# EAGLE design cubey_v2 (EAGLE 8.7.1)
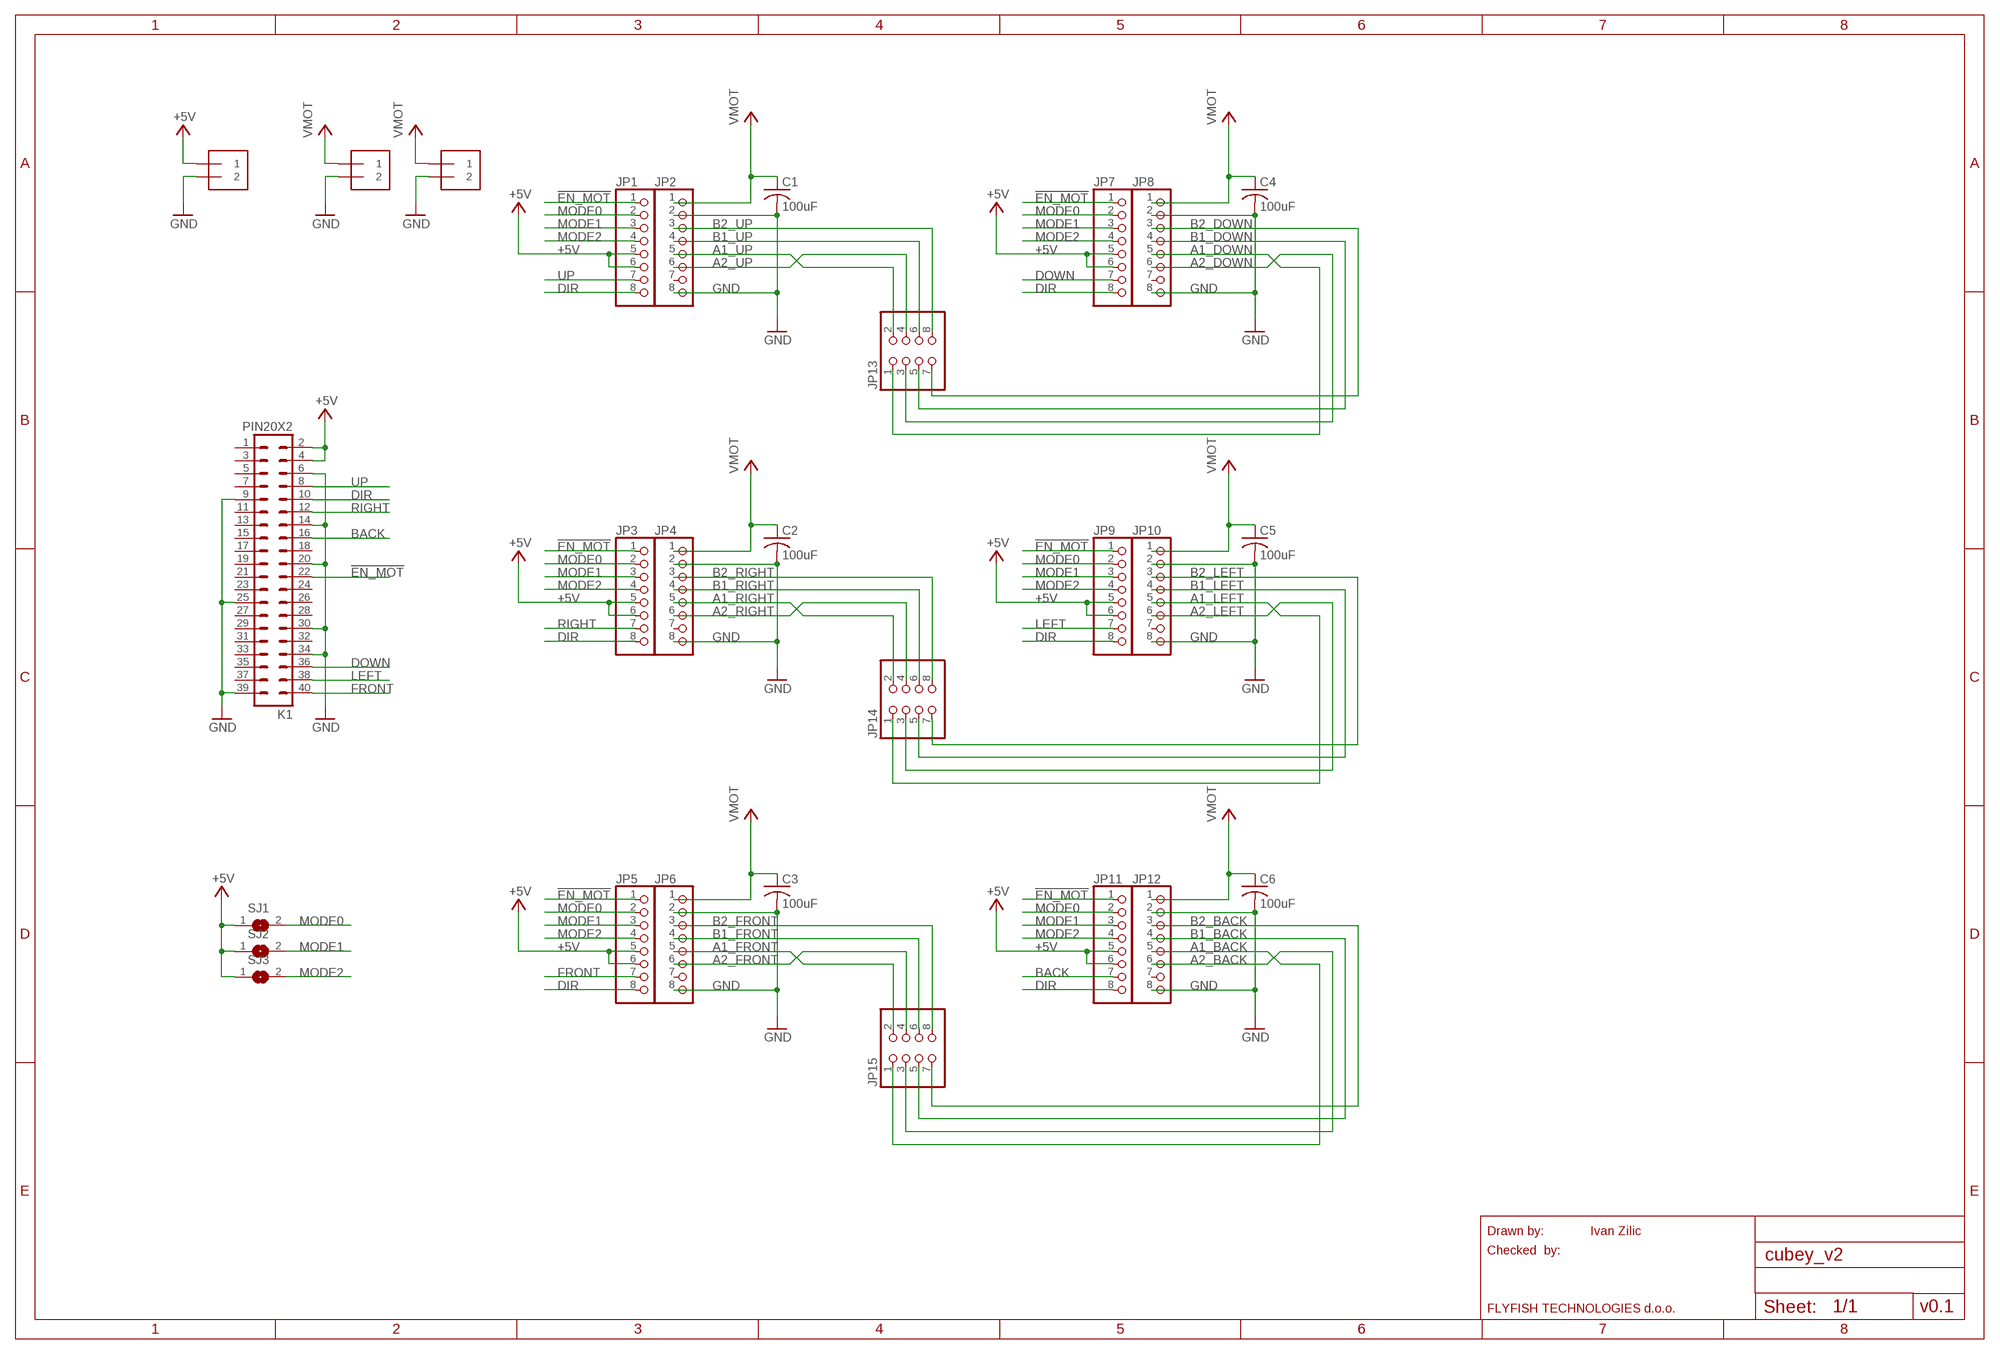
[diagram p0: schematic, sheet 1]

## Parts
5V_PWR  1X2-3.5MM  [1X2-3.5MM]
C1  100uF  C-US025-025X050  [C025-025X050]
C2  100uF  C-US025-025X050  [C025-025X050]
C3  100uF  C-US025-025X050  [C025-025X050]
C4  100uF  C-US025-025X050  [C025-025X050]
C5  100uF  C-US025-025X050  [C025-025X050]
C6  100uF  C-US025-025X050  [C025-025X050]
JP1  PINHD-1X8  [1X08]
JP2  PINHD-1X8  [1X08]
JP3  PINHD-1X8  [1X08]
JP4  PINHD-1X8  [1X08]
JP5  PINHD-1X8  [1X08]
JP6  PINHD-1X8  [1X08]
JP7  PINHD-1X8  [1X08]
JP8  PINHD-1X8  [1X08]
JP9  PINHD-1X8  [1X08]
JP10  PINHD-1X8  [1X08]
JP11  PINHD-1X8  [1X08]
JP12  PINHD-1X8  [1X08]
JP13  PINHD-2X4  [2X04]
JP14  PINHD-2X4  [2X04]
JP15  PINHD-2X4  [2X04]
K1  PIN20X2  [PIN_20X2]
MOT_PWR  1X2-3.5MM  [1X2-3.5MM]
MOT_PWR1  1X2-3.5MM  [1X2-3.5MM]
SJ1  SJ  [SJ]
SJ2  SJ  [SJ]
SJ3  SJ  [SJ]

## Nets
!EN_MOT: JP1.1 JP3.1 JP5.1 JP7.1 JP9.1 JP11.1 K1.22
+5V: 5V_PWR.1 JP1.5 JP1.6 JP3.5 JP3.6 JP5.5 JP5.6 JP7.5 JP7.6 JP9.5 JP9.6 JP11.5 JP11.6 K1.2 K1.4 SJ1.1 SJ2.1 SJ3.1
A1_BACK: JP12.5 JP15.1
A1_DOWN: JP8.5 JP13.1
A1_FRONT: JP6.5 JP15.2
A1_LEFT: JP10.5 JP14.1
A1_RIGHT: JP4.5 JP14.2
A1_UP: JP2.5 JP13.2
A2_BACK: JP12.6 JP15.3
A2_DOWN: JP8.6 JP13.3
A2_FRONT: JP6.6 JP15.4
A2_LEFT: JP10.6 JP14.3
A2_RIGHT: JP4.6 JP14.4
A2_UP: JP2.6 JP13.4
B1_BACK: JP12.4 JP15.5
B1_DOWN: JP8.4 JP13.5
B1_FRONT: JP6.4 JP15.6
B1_LEFT: JP10.4 JP14.5
B1_RIGHT: JP4.4 JP14.6
B1_UP: JP2.4 JP13.6
B2_BACK: JP12.3 JP15.7
B2_DOWN: JP8.3 JP13.7
B2_FRONT: JP6.3 JP15.8
B2_LEFT: JP10.3 JP14.7
B2_RIGHT: JP4.3 JP14.8
B2_UP: JP2.3 JP13.8
BACK: JP11.7 K1.16
DIR: JP1.8 JP3.8 JP5.8 JP7.8 JP9.8 JP11.8 K1.10
DOWN: JP7.7 K1.36
FRONT: JP5.7 K1.40
GND: 5V_PWR.2 C1.2 C2.2 C3.2 C4.2 C5.2 C6.2 JP2.2 JP2.8 JP4.2 JP4.8 JP6.2 JP6.8 JP8.2 JP8.8 JP10.2 JP10.8 JP12.2 JP12.8 K1.6 K1.9 K1.14 K1.20 K1.25 K1.30 K1.34 K1.39 MOT_PWR1.2 MOT_PWR.2
LEFT: JP9.7 K1.38
MODE0: JP1.2 JP3.2 JP5.2 JP7.2 JP9.2 JP11.2 SJ1.2
MODE1: JP1.3 JP3.3 JP5.3 JP7.3 JP9.3 JP11.3 SJ2.2
MODE2: JP1.4 JP3.4 JP5.4 JP7.4 JP9.4 JP11.4 SJ3.2
RIGHT: JP3.7 K1.12
UP: JP1.7 K1.8
VCC: C1.1 C2.1 C3.1 C4.1 C5.1 C6.1 JP2.1 JP4.1 JP6.1 JP8.1 JP10.1 JP12.1 MOT_PWR1.1 MOT_PWR.1 ; supply symbol labelled VMOT
Unconnected: JP2.7 JP4.7 JP6.7 JP8.7 JP10.7 JP12.7 K1.1 K1.3 K1.5 K1.7 K1.11 K1.13 K1.15 K1.17 K1.18 K1.19 K1.21 K1.23 K1.24 K1.26 K1.27 K1.28 K1.29 K1.31 K1.32 K1.33 K1.35 K1.37

## Notes on the sheet
- Drawn by: | Ivan Zilic
- Checked  by:
- FLYFISH TECHNOLOGIES d.o.o. | v0.1

## Library data of the parts
5V_PWR MOT_PWR MOT_PWR1 = adafruit:1X2: 3.5mm Terminal block http://www.ladyada.net/library/pcb/eaglelibrary.html
C1-C6 = rcl:C-US: CAPACITOR, American symbol; SPICEPREFIX: C
JP1-JP12 = pinhead:PINHD-1X8: PIN HEADER
JP13-JP15 = pinhead:PINHD-2X4: PIN HEADER
K1 = FLYFISH:PIN20X2
SJ1-SJ3 = jumper:SJ: SMD solder JUMPER

## Net classes
0 default: width 0.406 mm, clearance 0.203 mm

## Board
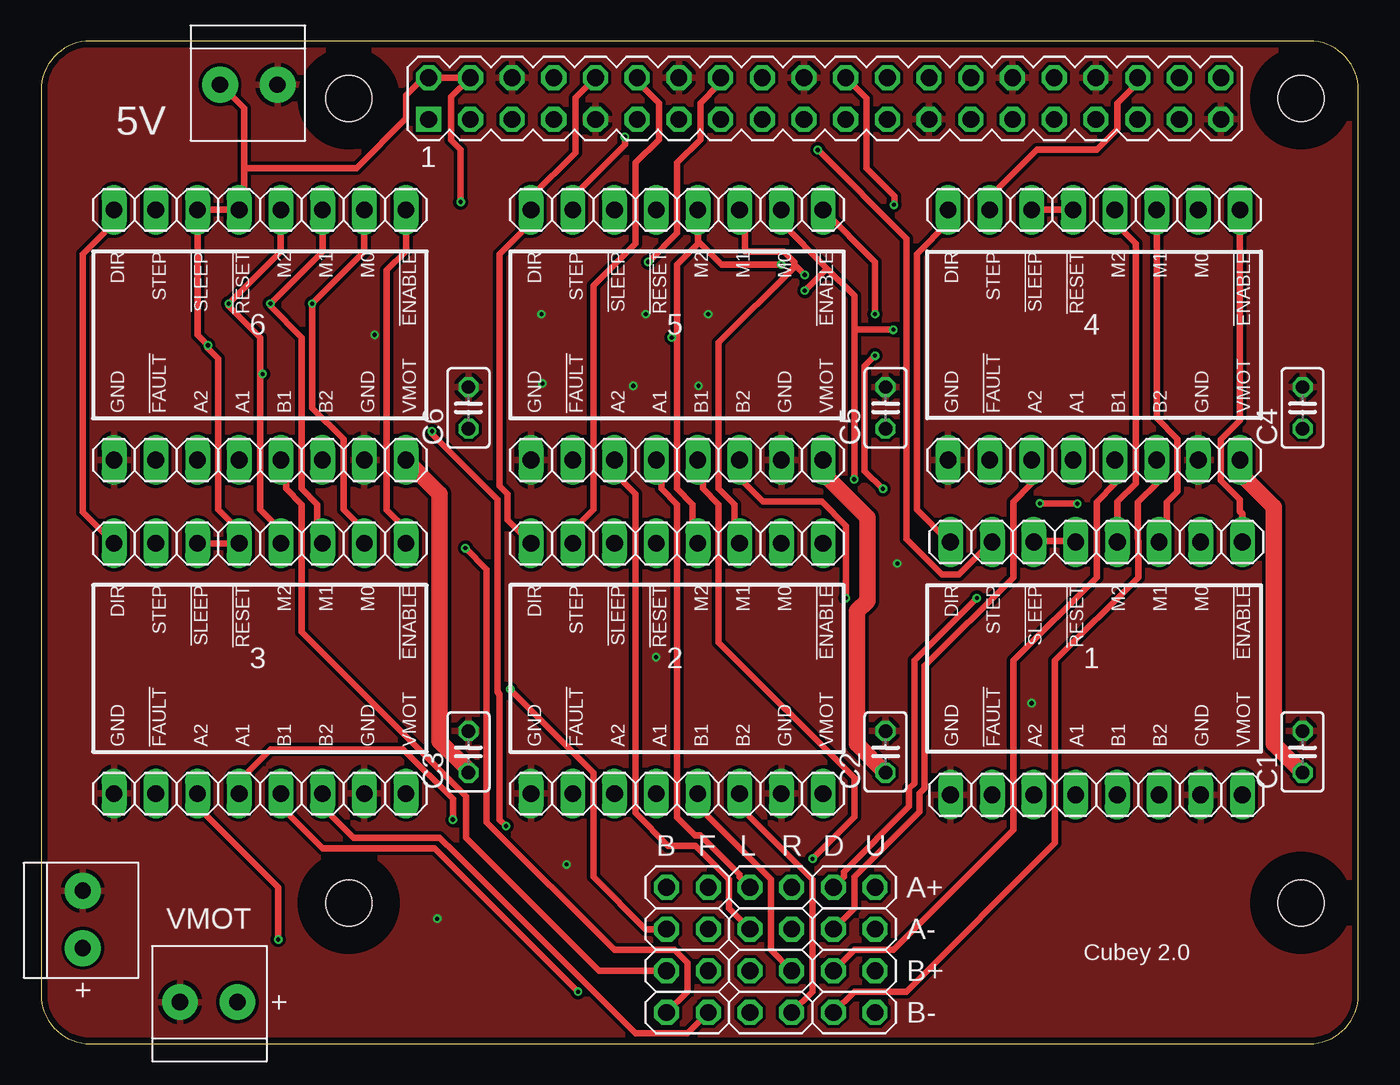
[diagram p1: board, top side]
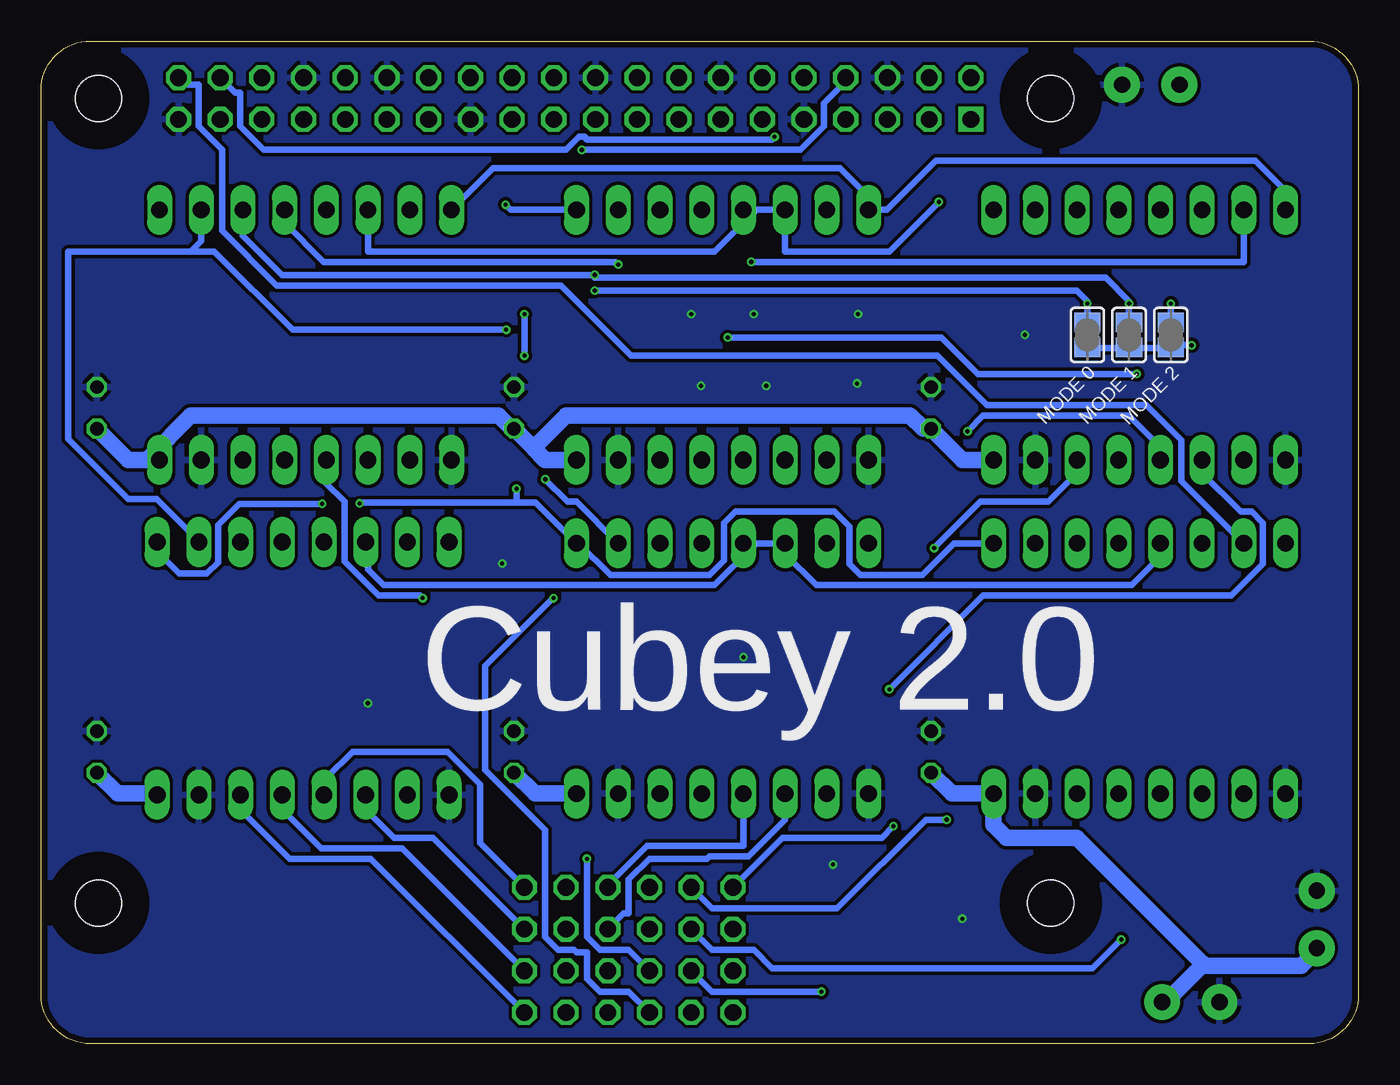
[diagram p2: board, bottom side, seen from below]

Size 80.24 x 61.08 mm. Coordinates in mm from the lower left corner, seen from the top.
Outline: 0,3 arc90 3,0 77.24,0 arc90 80.24,3 80.24,58.08 arc90 77.24,61.08 3,61.08 arc90 0,58.08 0,3
Copper layers (1*16): Top 0.035559375mm / dielectric 1.6mm / Bottom 0.035559375mm
Design rules "oshpark-2layer": minimum track width 6mil, minimum drill 10mil, track to track 6mil, track to pad 6mil, pad to pad 6mil, via to via 6mil, smd to smd 6mil, copper to edge 15mil, drill to drill 6mil, minimum pad ring 5mil, minimum via ring 5mil, stop-mask expansion 2.5mil, vias tented up to drill 0mil, thermal gap 10mil
Holes 2.8 mm at 18.74,8.58 18.74,57.58 76.74,57.58 76.74,8.58
tRestrict: area 17.2,56 to 20.3,59.1; area 75.2,56 to 78.3,59.1; area 75.2,7 to 78.3,10.1; area 17.2,7 to 20.3,10.1
bRestrict: area 17.2,7 to 20.3,10.1; area 17.2,56 to 20.3,59.1; area 75.2,7 to 78.3,10.1; area 75.2,56 to 78.3,59.1

### Footprints (pad centres in the part's own frame; a part is rotated, then mirrored left to right if it is on the bottom)
1X2-3.5MM = drill 1 pad 2.184: 1 1.8,0; 2 -1.7,0
C025-025X050 = drill 0.813 octagon: 1 -1.27,0; 2 1.27,0
1X08 = drill 1.016 long: 1 -8.89,0; 2 -6.35,0; 3 -3.81,0; 4 -1.27,0; 5 1.27,0; 6 3.81,0; 7 6.35,0; 8 8.89,0
2X04 = drill 1.016 octagon: 1 -3.81,-1.27; 2 -3.81,1.27; 3 -1.27,-1.27; 4 -1.27,1.27; 5 1.27,-1.27; 6 1.27,1.27; 7 3.81,-1.27; 8 3.81,1.27
PIN_20X2 = drill 1.016 square: 1 -24.13,-1.27 | drill 1.016 octagon: 2 -24.13,1.27; 3 -21.59,-1.27; 4 -21.59,1.27; 5 -19.05,-1.27; 6 -19.05,1.27; 7 -16.51,-1.27; 8 -16.51,1.27; 9 -13.97,-1.27; 10 -13.97,1.27; 11 -11.43,-1.27; 12 -11.43,1.27; 13 -8.89,-1.27; 14 -8.89,1.27; 15 -6.35,-1.27; 16 -6.35,1.27; 17 -3.81,-1.27; 18 -3.81,1.27; 19 -1.27,-1.27; 20 -1.27,1.27; 21 1.27,-1.27; 22 1.27,1.27; 23 3.81,-1.27; 24 3.81,1.27; 25 6.35,-1.27; 26 6.35,1.27; 27 8.89,-1.27; 28 8.89,1.27; 29 11.43,-1.27; 30 11.43,1.27; 31 13.97,-1.27; 32 13.97,1.27; 33 16.51,-1.27; 34 16.51,1.27; 35 19.05,-1.27; 36 19.05,1.27; 37 21.59,-1.27; 38 21.59,1.27; 39 24.13,-1.27; 40 24.13,1.27
SJ = smd 1.168 x 1.6: 1 -0.762,0; 2 0.762,0

### Placement (x,y rotation side)
5V_PWR  12.7,58.42 180 top
C1  76.83,17.78 90 top
C2  51.44,17.78 90 top
C3  26.04,17.78 90 top
C4  76.83,38.73 90 top
C5  51.44,38.73 90 top
C6  26.04,38.73 90 top
JP1  64.28,30.57 180 top
JP2  64.28,15.16 180 top
JP3  38.73,30.48 180 top
JP4  38.73,15.24 180 top
JP5  13.34,30.48 180 top
JP6  13.34,15.24 180 top
JP7  64.14,50.8 180 top
JP8  64.14,35.56 180 top
JP9  38.73,50.8 180 top
JP10  38.73,35.56 180 top
JP11  13.34,50.8 180 top
JP12  13.34,35.56 180 top
JP13  49.53,5.71 270 top
JP14  44.45,5.71 270 top
JP15  39.37,5.71 270 top
K1  47.74,57.58 0 top
MOT_PWR  10.16,2.54 0 top
MOT_PWR1  2.54,7.62 270 top
SJ1  16.51,43.18 90 bottom
SJ2  13.97,43.18 90 bottom
SJ3  11.43,43.18 90 bottom

### Tracks (layer width: path | path; a pad name or v marks a point on that pad's centre or on a via)
!EN_MOT  (via drill 0.25)
  Top 0.406: JP7.1 73.03,37.97 71.86,36.81 71.86,34.31 73.03,33.15 73.03,32.44 73.17,32.29 JP1.1 | v60.83,32.92 63.09,32.92 v63.12,32.89 | JP9.1 50.8,47.62 v50.8,44.45 | v50.8,41.91 50.16,41.27 50.16,34.9 51.26,33.81 v51.28,33.81 | JP11.1 22.23,48.28 21.06,47.12 21.06,32.51 22.25,31.32 22.25,30.5 JP5.1 | K1.22 50.27,57.59 50.27,53.34 51.97,51.64 51.97,51.13 v51.94,51.1
  Bottom 0.406: v60.83,32.92 60.78,32.97 51.28,32.97 | v63.12,32.89 68.18,32.89 69.46,31.61 69.46,29.32 70.15,28.64 71.81,28.64 73.17,29.99 JP1.1 | 51.28,32.97 50.11,32.97 JP3.1 47.5,30.48 45.57,28.55 39.52,28.55 38.63,29.44 38.63,31.73 37.95,32.41 31.9,32.41 31.01,31.52 31.01,29.23 30.33,28.55 26.55,28.55 24.62,30.48 JP5.1 | v50.8,44.45 v50.8,41.91 | v51.28,33.81 51.28,32.97 | v51.94,51.1 51.64,50.8 JP9.1
+5V  (via drill 0.25)
  Top 0.406: JP7.5 JP7.6 | JP1.6 60.48,30.64 62.87,30.64 JP1.5 | JP5.6 JP5.5 11.59,30.64 11.59,31.75 10.79,32.54 10.79,41.75 10.16,42.39 v10.16,42.55 9.53,43.18 JP11.6 JP11.5 12.06,51.91 12.38,52.23 12.38,53.34 | 12.38,53.34 19.21,53.34 22.23,56.37 22.23,57.8 23.29,58.85 K1.2 K1.4 24.98,57.68 24.98,55.03 25.56,54.45 v25.56,51.28 | 12.38,53.34 12.38,56.99 10.95,58.42 5V_PWR.1
  Bottom 0.406: SJ1.1 16.51,42.39 14.13,42.39 SJ2.1 13.97,42.39 11.43,42.39 SJ3.1 11.27,42.55 v10.16,42.55 | JP5.5 12.06,29.69 13.81,27.94 33.02,27.94 34.92,29.84 JP3.6 JP3.5 36.83,30.32 39.21,27.94 59.37,27.94 60.33,28.89 60.33,30.48 JP1.6 | v25.56,51.28 28.57,48.26 34.92,48.26 JP9.6 JP9.5 36.83,50.64 39.21,48.26 60.33,48.26 JP7.6
A1_BACK  (via drill 0.25)
  Top 0.406: v23.81,37.31 23.81,37.15 27.81,33.15 27.81,21.42 27.94,21.29 27.94,13.64 v28.32,13.26
  Bottom 0.406: JP15.1 35.08,12.54 29.04,12.54 v28.32,13.26 | v23.81,37.31 22.86,38.26 13.97,38.26 12.06,36.35 JP12.5
A1_DOWN  (via drill 0.25)
  Top 0.406: JP13.1 48.9,10.16 48.9,10.48 52.86,14.45 52.86,15.56 53.18,15.88 53.18,23.34 v56.99,27.15
  Bottom 0.406: v56.99,27.15 57.15,27.3 59.69,27.3 61.75,29.37 61.75,33.02 62.87,34.13 JP8.5
A1_FRONT  (via drill 0.25)
  Top 0.406: JP6.5 12.54,15.72 12.54,16.51 13.97,17.94 22.07,17.94 25.08,14.92 v25.08,13.65
  Bottom 0.406: JP15.2 39.37,8.26 31.75,8.26 26.35,13.65 v25.08,13.65
A1_LEFT
  Top 0.406: JP14.1 42.55,10.16 42.55,10.32 40.16,12.7 39.83,12.7 38.73,13.79 38.73,32.86 37.78,33.81 37.78,34.13 37.47,34.45 JP10.5
A1_RIGHT
  Bottom 0.406: JP4.5 37.47,12.06 43.34,12.06 45.72,9.68 JP14.2
A1_UP
  Bottom 0.406: JP13.2 53.5,12.22 53.5,15.81 55.47,17.78 61.28,17.78 62.87,16.19 62.87,15.24 JP2.5
A2_BACK  (via drill 0.25)
  Top 0.406: JP15.3 36.83,6.99 33.66,10.16 33.66,16.51 v28.57,21.59
  Bottom 0.406: v28.57,21.59 22.86,27.3 7.75,27.3 5.82,29.23 5.82,31.73 6.5,32.41 7.17,32.41 9.53,34.77 JP12.6
A2_DOWN
  Top 0.406: JP13.3 49.53,8.26 49.53,10.16 53.5,14.13 53.5,15.24 53.82,15.56 53.82,23.02 59.21,28.42 59.21,33.01 60.33,34.12 JP8.6
A2_FRONT  (via drill 0.25)
  Top 0.406: JP6.6 10,14.76 10,13.97 14.45,9.53 v14.45,6.35
  Bottom 0.406: JP15.4 39.37,5.71 36.83,5.71 35.72,4.6 16.19,4.6 v14.45,6.35
A2_LEFT
  Top 0.406: JP14.3 41.91,8.26 41.91,10 39.85,12.06 38.19,12.06 36.2,14.06 36.2,33.5 34.92,34.77 JP10.6
A2_RIGHT
  Bottom 0.406: JP4.6 34.92,13.65 35.4,13.18 37.15,11.43 39.53,11.43 39.69,11.27 43.18,11.27 44.45,10 44.45,7.94 44.77,7.94 JP14.4
A2_UP
  Bottom 0.406: JP13.4 56.36,12.54 58.74,12.54 60.33,14.13 60.33,15.08 JP2.6
B1_BACK
  Top 0.406: JP15.5 33.97,4.45 33.34,5.08 25.88,12.54 25.88,15.08 24.92,16.03 24.77,16.19 15.88,25.08 15.88,32.86 14.92,33.81 14.92,34.13 14.61,34.45 JP12.4
B1_DOWN
  Top 0.406: JP13.5 49.53,5.71 51.91,5.71 59.21,13.02 59.21,23.34 64.29,28.42 64.29,33.01 65.41,34.12 JP8.4
B1_FRONT  (via drill 0.25)
  Top 0.406: JP6.4 15.08,14.76 15.08,13.97 17.14,11.91 18.57,11.91 19.05,11.91 23.97,11.91 v32.7,3.17
  Bottom 0.406: v32.7,3.17 39.37,3.17 JP15.6
B1_LEFT  (via drill 0.25)
  Top 0.406: v46.99,11.27 49.53,13.81 49.53,16.19 41.27,24.45 41.27,32.86 40.32,33.81 40.32,34.13 40.01,34.45 JP10.4
  Bottom 0.406: JP14.5 44.45,5.71 46.2,5.71 46.99,6.51 v46.99,11.27
B1_RIGHT
  Top 0.406: JP14.6 44.45,5.71 44.45,10 40.01,14.45 JP4.4
B1_UP
  Bottom 0.406: JP13.6 58.26,11.91 63.18,11.91 65.41,14.13 65.41,15.08 JP2.4
B2_BACK  (via drill 0.25)
  Top 0.406: JP15.7 39.37,3.17 39.37,4.92 38.58,5.71 34.92,5.71 27.15,13.49 27.15,28.89 v25.84,30.19
  Bottom 0.406: v25.84,30.19 23.02,33.02 19.21,33.02 18.89,33.02 17.14,34.77 JP12.3
B2_DOWN
  Top 0.406: JP13.7 49.53,3.17 52.7,3.17 61.75,12.22 61.75,23.34 66.83,28.42 66.82,32.99 67.93,34.1 JP8.3
B2_FRONT
  Top 0.406: JP6.3 17.62,14.76 17.62,13.97 19.05,12.54 24.29,12.54 25.24,11.59 36.2,0.64 39.37,0.64 40.16,1.43 JP15.8
B2_LEFT  (via drill 0.25)
  Top 0.406: v49.02,27.15 49.02,31.55 47.55,33.02 43.97,33.02 42.86,34.13 42.55,34.45 JP10.3
  Bottom 0.406: JP14.7 44.45,3.17 46.2,3.17 46.99,3.97 46.99,5.56 47.62,5.56 47.78,5.71 48.74,5.71 49.53,6.51 49.53,13.02 53.18,16.67 53.18,23.02 49.05,27.15 v49.02,27.15
B2_RIGHT
  Top 0.406: JP14.8 46.99,3.17 46.99,10 42.55,14.45 JP4.3
B2_UP
  Bottom 0.406: JP13.8 60.17,11.27 65.09,11.27 67.94,14.13 67.94,15.08 JP2.3
BACK  (via drill 0.25)
  Top 0.406: v36.99,47.62 38.73,49.37 38.73,53.66 40.16,55.09 40.16,57.31 41.27,58.42 41.27,58.74 K1.16
  Bottom 0.406: JP11.7 6.99,47.62 v36.99,47.62
DIR
  Top 0.406: JP7.8 55.24,50.01 53.34,48.1 53.34,32.54 55.24,30.64 JP1.8 | JP5.8 2.54,32.38 2.54,48.1 4.45,50.01 JP11.8 | JP3.8 28.42,31.91 28.42,33.5 27.94,33.97 27.94,48.1 29.84,50.01 JP9.8 29.84,51.59 32.54,54.29 32.54,57.63 33.66,58.74 K1.10
  Bottom 0.406: JP11.8 4.45,51.97 6.28,53.81 25.73,53.81 28.73,50.8 JP9.8 29.84,51.59 31.59,53.34 52.7,53.34 JP7.8
DOWN
  Top 0.406: JP7.7 58.26,51.28 58.26,52.07 60.64,54.45 64.31,54.45 65.56,55.7 65.56,57.31 66.67,58.42 66.67,58.74 K1.36
FRONT
  Bottom 0.406: JP5.7 10.79,34.29 10.79,36.77 12.92,38.89 22.64,38.89 25.65,41.91 44.29,41.91 48.58,46.2 65.88,46.2 69.22,49.53 69.22,54.45 70.64,55.88 70.64,58.42 71.28,58.42 71.6,58.74 71.75,58.74 K1.40
GND  (via drill 0.25)
  other vias: 24.13,7.62 32,10.92 20.32,43.18 30.48,44.45 36.83,44.45 40.64,44.45 40.04,40.08 36.07,40.08 30.54,40.22 60.33,20.75 37.45,23.55 52.15,29.26
  pour Top: -3.81,63.5 86.36,63.5 86.36,-1.27 -3.81,-1.27
  pour Bottom: -1.27,66.04 83.82,66.04 83.82,-2.54 -1.27,-2.54
LEFT  (via drill 0.25)
  Top 0.406: JP9.7 32.86,51.28 32.86,52.07 35.56,54.77 v35.56,55.24
  Bottom 0.406: v35.56,55.24 35.72,55.09 46.99,55.09 47.15,55.24 47.47,55.24 48.26,54.45 66.67,54.45 68.1,55.88 68.1,57.94 68.42,57.94 69.22,58.74 K1.38
MODE0  (via drill 0.25)
  Top 0.406: JP11.2 19.68,48.26 v16.51,45.09 16.51,38.73 18.41,36.83 18.41,32.54 19.21,31.75 19.21,30.96 JP5.2 | 49.53,43.5 49.53,45.56 47.86,47.23 | 49.53,43.5 v49.53,34.38 | 47.86,47.23 45.09,50.01 JP9.2 | 47.86,47.23 v46.51,45.88 | 49.53,43.5 v51.91,43.5
  Bottom 0.406: 71.12,48.26 69.69,48.26 64.93,43.5 v51.91,43.5 | 71.12,48.26 78.58,48.26 78.58,36.83 74.93,33.18 73.18,33.18 70.64,30.64 JP1.2 | 70.48,50.01 JP7.2 70.48,48.9 71.12,48.26 | SJ1.2 v16.51,45.09 16.51,45.24 17.14,45.88 v46.51,45.88 | JP3.2 47.62,33.02 48.16,33.02 v49.53,34.38
MODE1  (via drill 0.25)
  Top 0.406: JP11.3 17.14,48.26 v13.97,45.09 13.97,44.93 15.88,43.02 15.88,33.81 16.83,32.86 16.83,30.8 JP5.3 | JP3.3 42.23,30.8 42.23,32.86 41.27,33.81 41.27,42.7 45.88,47.31 | 45.88,47.31 45.88,47.62 45.24,48.26 42.86,48.26 42.86,49.37 42.55,49.69 JP9.3 | v46.51,46.83 46.04,47.31 45.88,47.31 | JP7.3 67.94,38.1 69.22,36.83 69.22,33.64 68.58,33.01 68.58,31.11 68.1,30.64 JP1.3
  Bottom 0.406: SJ2.2 v13.97,45.09 13.97,45.24 15.4,46.67 46.51,46.67 v46.51,46.83 65.56,46.83 67.94,49.21 JP7.3
MODE2  (via drill 0.25)
  Top 0.406: JP11.4 14.61,48.26 v11.43,45.09 11.43,44.93 13.34,43.02 13.34,40.8 | JP5.4 14.13,30.96 14.13,31.75 13.34,32.54 13.34,40.8 | JP3.4 39.69,30.8 39.69,32.86 38.73,33.81 38.73,43.02 | 38.73,43.02 38.73,47.47 40.01,48.74 | JP9.4 40.01,48.74 | JP7.4 65.88,50.32 65.88,49.53 66.67,48.74 66.67,34.13 65.56,33.02 65.56,30.64 JP1.4 | v45.09,47.47 41.43,47.47 40.16,48.74 40.01,48.74 | v13.49,40.8 13.34,40.8 | v38.42,43.02 38.73,43.02
  Bottom 0.406: v11.43,45.09 SJ3.2 | v45.09,47.47 45.24,47.62 63.02,47.62 65.41,50.01 JP7.4 | v13.49,40.8 23.18,40.8 25.4,43.02 v38.42,43.02
RIGHT
  Top 0.406: JP3.7 32.86,30.96 32.86,31.75 33.66,32.54 33.66,46.2 36.2,48.74 36.2,53.66 37.62,55.09 37.62,57.31 36.35,58.58 36.35,58.74 K1.12
UP  (via drill 0.25)
  Top 0.406: v47.31,54.45 52.7,49.05 52.7,30.74 54.86,28.58 55.92,28.58 57.47,30.13 57.47,30.16 57.78,30.48 JP1.7
  Bottom 0.406: v47.31,54.45 33.97,54.45 32.54,55.88 32.54,57.31 32.07,57.78 31.11,58.74 K1.8
VCC
  Top 0.406: C3.1 26.04,16.67
  Top 1.016: C2.1 49.69,18.26 49.69,26.35 50.32,26.99 50.32,32.07 47.62,34.77 JP10.1 | C1.1 75.09,18.26 75.09,32.7 73.03,34.77 JP8.1 | JP12.1 24.29,33.5 24.29,18.41 26.04,16.67
  Bottom 0.406: 73.18,15.24 JP2.1 | 51.59,37.47 C5.1 | 73.66,35.72 JP8.1 | MOT_PWR.1 11.75,2.54 | 2.54,5.71 MOT_PWR1.1 | 9.53,4.92 9.53,4.76
  Bottom 1.016: C2.1 50.16,15.24 JP4.1 | 50.24,36.27 49.53,35.56 JP10.1 | 50.24,36.27 C5.1 | C1.1 75.56,15.24 73.18,15.24 | C4.1 74.93,35.56 JP8.1 | 51.59,37.47 52.39,38.26 71.12,38.26 73.66,35.72 | JP12.1 24.13,35.56 C6.1 26.51,37.47 27.3,38.26 48.26,38.26 50.24,36.27 | 2.54,5.71 3.49,4.76 9.53,4.76 11.75,2.54 | 9.53,4.92 17.14,12.54 21.43,12.54 22.23,13.34 JP6.1 24.77,15.24 C3.1

### Text on the board
tNames: 5V | DIR | STEP | !SLEEP | !RESET | M2 | M1 | M0 | !ENABLE | DIR | STEP | !SLEEP | !RESET | M2 | M1 | M0 | !ENABLE | DIR | STEP | !SLEEP | !RESET | M2 | M1 | M0 | !ENABLE | 6 | 5 | 4 | GND | !FAULT | A2 | A1 | B1 | B2 | GND | VMOT | GND | !FAULT | A2 | A1 | B1 | B2 | GND | VMOT | GND | !FAULT | A2 | A1 | B1 | B2 | GND | VMOT | DIR | STEP | !SLEEP | !RESET | M2 | M1 | M0 | !ENABLE | DIR | STEP | !SLEEP | !RESET | M2 | M1 | M0 | !ENABLE | DIR | STEP | !SLEEP | !RESET | M2 | M1 | M0 | !ENABLE | 3 | 2 | 1 | GND | !FAULT | A2 | A1 | B1 | B2 | GND | VMOT | GND | !FAULT | A2 | A1 | B1 | B2 | GND | VMOT | GND | !FAULT | A2 | A1 | B1 | B2 | GND | VMOT | B | F | L | R | D | U | A+ | VMOT | A- | Cubey 2.0 | + | B+ | + | B-
bNames: MODE 2 | MODE 1 | MODE 0 | Cubey 2.0